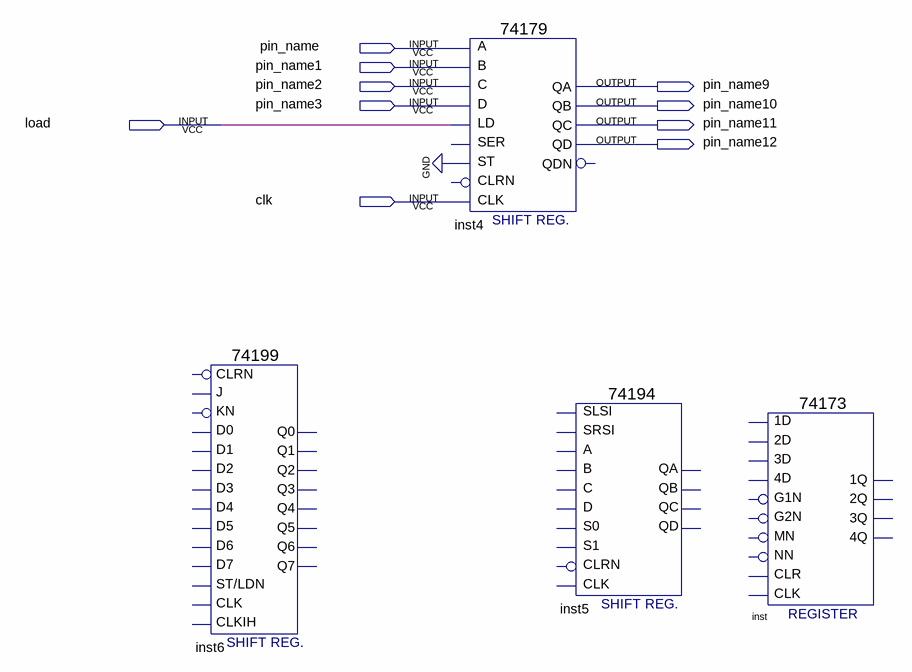
[diagram p0: schematic sheet]
// Quartus schematic Bi.bdf as structural Verilog: 4 symbols, 10 pins
module Bi (
  input  pin_name,
  input  pin_name1,
  input  pin_name2,
  input  pin_name3,
  input  load,
  input  clk,
  output pin_name9,
  output pin_name10,
  output pin_name11,
  output pin_name12
);

  \74199  inst6 ();  // open: KN, CLRN, ST/LDN, CLK, J, D3, D2, D1, D0, D7, D6, CLKIH, D4, D5, Q5, Q6, Q7, Q2, Q3, Q4, Q0, Q1
  \74179  inst4 (
    .A(pin_name), .B(pin_name1), .LD(load), .D(pin_name3), .C(pin_name2), .ST(1'b0), .CLK(clk),
    .QD(pin_name12), .QB(pin_name10), .QC(pin_name11), .QA(pin_name9));  // open: SER, CLRN, QDN
  \74194  inst5 ();  // open: SLSI, SRSI, B, C, CLK, CLRN, D, S1, S0, A, QA, QB, QC, QD
  \74173  inst ();  // open: 3D, MN, 1D, 2D, 4D, G1N, G2N, NN, CLR, CLK, 3Q, 2Q, 1Q, 4Q
endmodule
